# EAGLE design Wattuino-Uno_v11 (EAGLE 7.5.0)
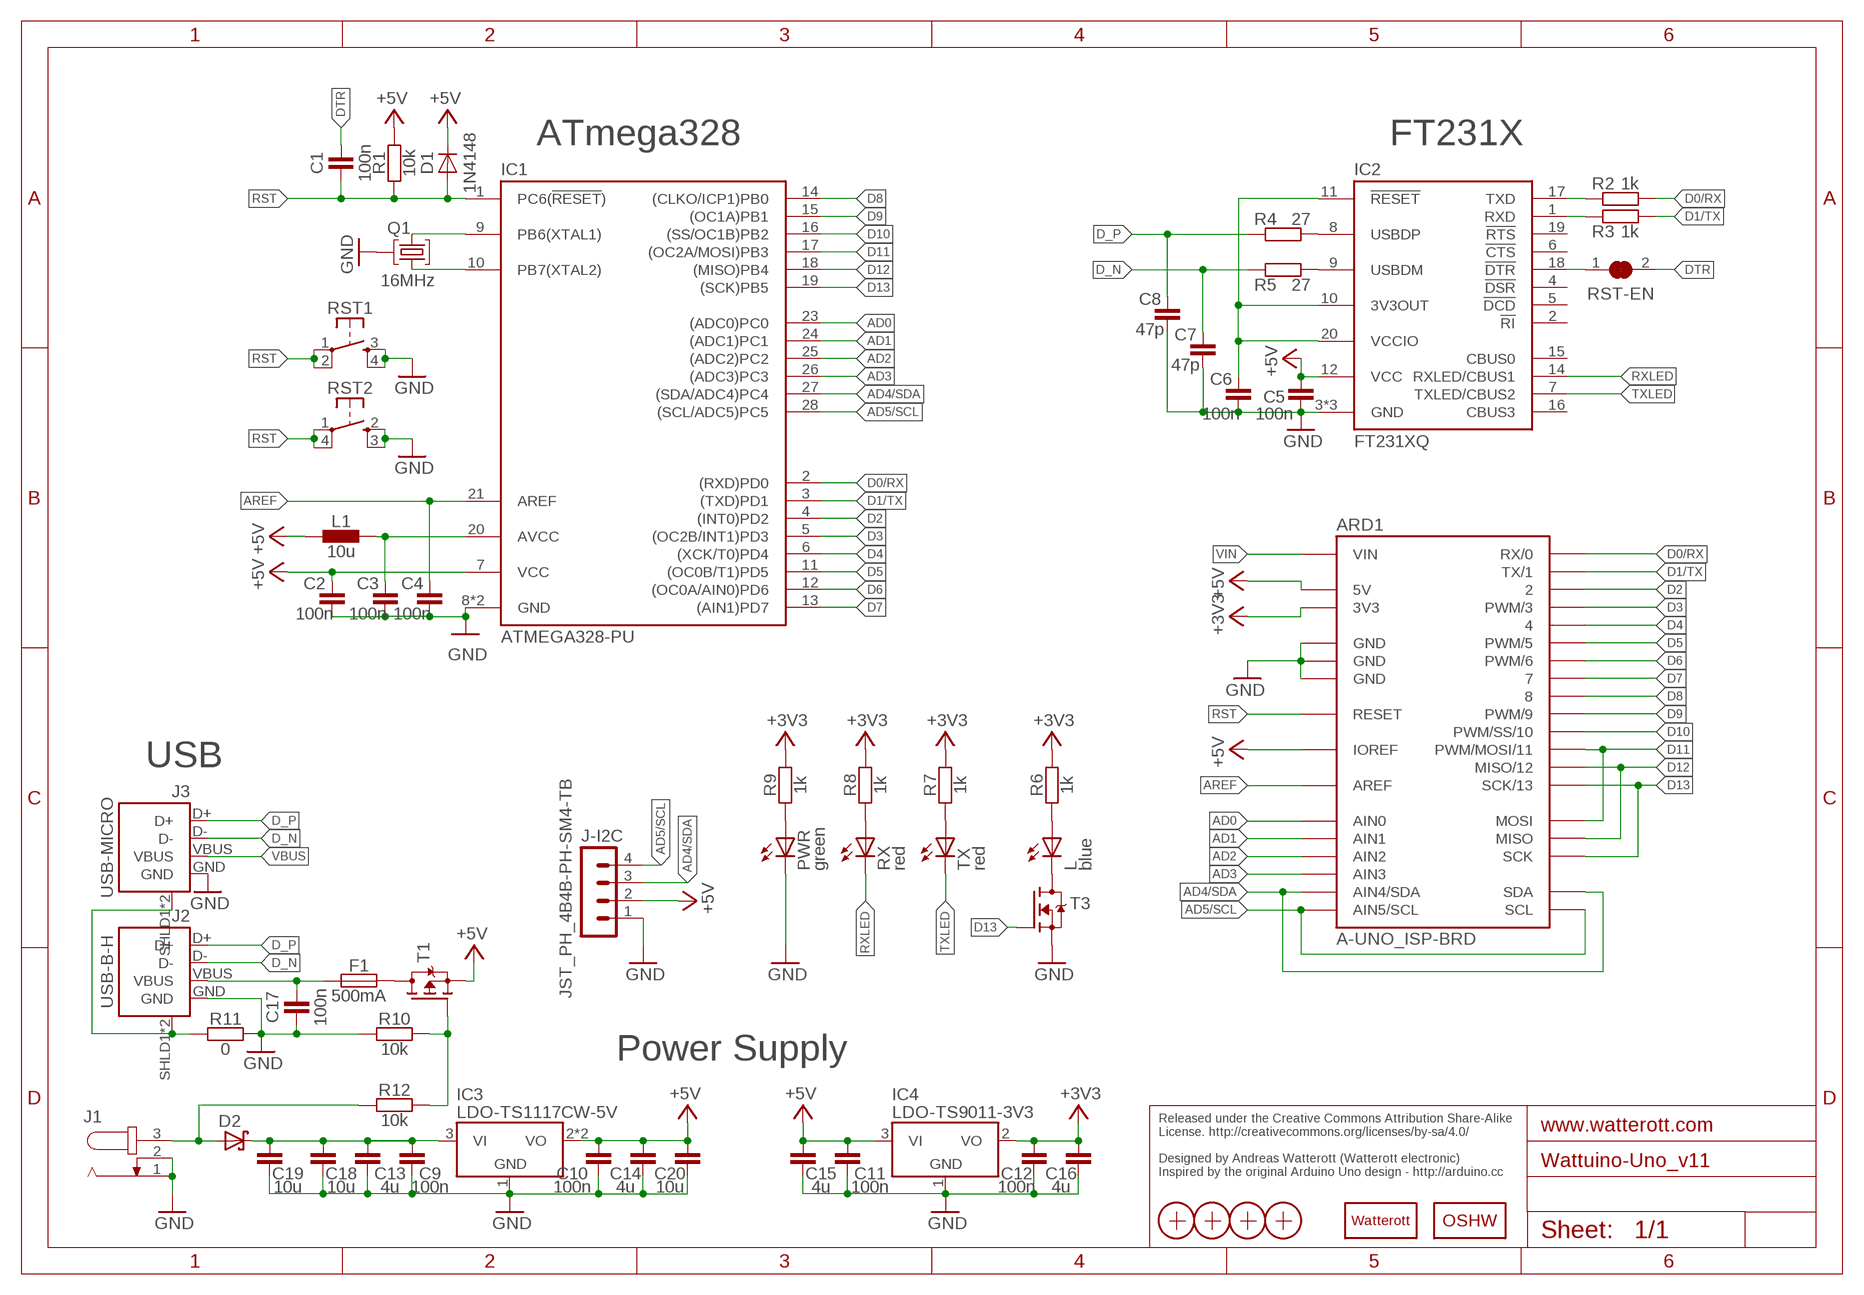
[diagram p0: schematic, sheet 1]

## Parts
ARD1  A-UNO_ISP-BRD  [A-UNO-ISP]
C1  100n  CAPACITOR-0402  [C0402]
C2  100n  CAPACITOR-0402  [C0402]
C3  100n  CAPACITOR-0402  [C0402]
C4  100n  CAPACITOR-0402  [C0402]
C5  100n  CAPACITOR-0402  [C0402]
C6  100n  CAPACITOR-0402  [C0402]
C7  47p  CAPACITOR-0402  [C0402]
C8  47p  CAPACITOR-0402  [C0402]
C9  100n  CAPACITOR-0402  [C0402]
C10  100n  CAPACITOR-0402  [C0402]
C11  100n  CAPACITOR-0402  [C0402]
C12  100n  CAPACITOR-0402  [C0402]
C13  4u  CAPACITOR-0603  [C0603]
C14  4u  CAPACITOR-0603  [C0603]
C15  4u  CAPACITOR-0603  [C0603]
C16  4u  CAPACITOR-0603  [C0603]
C17  100n  CAPACITOR-0402  [C0402]
C18  10u  CAPACITOR-1206  [C1206]
C19  10u  CAPACITOR-1206  [C1206]
C20  10u  CAPACITOR-1206  [C1206]
D1  1N4148  DIODE-SOD110  [SOD110]
D2  D_SCHOTTKY-SMA  [SMA_DO214AC]
F1  500mA  FUSE-0805  [C0805]
IC1  ATMEGA328-PU  [DIL28]
IC2  FT231XQ  [QFN20-PAD]
IC3  LDO-TS1117CW-5V  [SOT223]
IC4  LDO-TS9011-3V3  [SOT23]
J1  DC-JACK  [DC-JACK]
J2  USB-B-H  [USB-B-H]
J3  USB-MICRO  [USB-MICRO-10103594]
J-I2C  JST_PH_4B4B-PH-SM4-TB  [JST_B4B-PH-SM4-TB]
L  blue  LED-0603  [C0603]
L1  10u  INDUCTOR-0603  [C0603]
LOGO1  LOGO-S_PLACE_M  [SPARK_TPLACE_M]
LOGO2  OSHW_LOGOX0100  [OSHW_6X100]
PWR  green  LED-0603  [C0603]
Q1  16MHz  CRYSTAL-RES-32  [CRYSTAL_32X13]
R1  10k  RESISTOR-0402  [C0402]
R2  1k  RESISTOR-0402  [C0402]
R3  1k  RESISTOR-0402  [C0402]
R4  27  RESISTOR-0402  [C0402]
R5  27  RESISTOR-0402  [C0402]
R6  1k  RESISTOR-0402  [C0402]
R7  1k  RESISTOR-0402  [C0402]
R8  1k  RESISTOR-0402  [C0402]
R9  1k  RESISTOR-0402  [C0402]
R10  10k  RESISTOR-0402  [C0402]
R11  0  RESISTOR-0402  [C0402]
R12  10k  RESISTOR-0402  [C0402]
RST1  SW-TACTILE-PTS840P  [PTS840P]
RST2  SW-TACTILE-TL3315  [TL3315N]
RST-EN  JUMPER2-0603  [JUMPER2-0603]
RX  red  LED-0603  [C0603]
T1  MOSFET-P-SOT23  [SOT23]
T3  MOSFET-N-SOT23  [SOT23]
TX  red  LED-0603  [C0603]
X1  PASSER-07  [PASSER_07MM]
X2  PASSER-07  [PASSER_07MM]
X3  PASSER-07  [PASSER_07MM]
X4  PASSER-07  [PASSER_07MM]

## Nets
3V3OUT: C6.2 IC2.10(3V3OUT) IC2.11(!RESET) IC2.20(VCCIO)
+3V3: ARD1.3V3 C12.2 C16.2 IC4.2(VO) R6.2 R7.2 R8.2 R9.2
+5V: ARD1.5V ARD1.IOREF ARD1.VCC(5V) C2.2 C5.2 C10.2 C11.2 C14.2 C15.2 C20.2 D1.C IC1.7(VCC) IC2.12(VCC) IC3.2(VO) IC3.4(VO) IC4.3(VI) J-I2C.2 L1.1 R1.2 T1.2(S)
AD0: ARD1.A0(AIN0) IC1.23((ADC0)PC0)
AD1: ARD1.A1(AIN1) IC1.24((ADC1)PC1)
AD2: ARD1.A2(AIN2) IC1.25((ADC2)PC2)
AD3: ARD1.A3(AIN3) IC1.26((ADC3)PC3)
AD4/SDA: ARD1.A4(AIN4/SDA) ARD1.SDA IC1.27((SDA/ADC4)PC4) J-I2C.3
AD5/SCL: ARD1.A5(AIN5/SCL) ARD1.SCL IC1.28((SCL/ADC5)PC5) J-I2C.4
AREF: ARD1.AREF C4.2 IC1.21(AREF)
AVCC: C3.2 IC1.20(AVCC) L1.2
D0/RX: ARD1.0(RX/0) IC1.2((RXD)PD0) R2.2
D1/TX: ARD1.1(TX/1) IC1.3((TXD)PD1) R3.2
D2: ARD1.2 IC1.4((INT0)PD2)
D3: ARD1.3(PWM/3) IC1.5((OC2B/INT1)PD3)
D4: ARD1.4 IC1.6((XCK/T0)PD4)
D5: ARD1.5(PWM/5) IC1.11((OC0B/T1)PD5)
D6: ARD1.6(PWM/6) IC1.12((OC0A/AIN0)PD6)
D7: ARD1.7 IC1.13((AIN1)PD7)
D8: ARD1.8 IC1.14((CLKO/ICP1)PB0)
D9: ARD1.9(PWM/9) IC1.15((OC1A)PB1)
D10: ARD1.10(PWM/SS/10) IC1.16((SS/OC1B)PB2)
D11: ARD1.11(PWM/MOSI/11) ARD1.MOSI IC1.17((OC2A/MOSI)PB3)
D12: ARD1.12(MISO/12) ARD1.MISO IC1.18((MISO)PB4)
D13: ARD1.13(SCK/13) ARD1.SCK IC1.19((SCK)PB5) T3.1(G)
D_N: C7.2 J2.D- J3.D- R5.1
D_P: C8.2 J2.D+ J3.D+ R4.1
DN: IC2.9(USBDM) R5.2
DP: IC2.8(USBDP) R4.2
DTR: C1.2 RST-EN.2
DTR_FT: IC2.18(!DTR) RST-EN.1
GND: ARD1.GND@1(GND) ARD1.GND@2(GND) ARD1.GND@3(GND) ARD1.GND@4(GND) C2.1 C3.1 C4.1 C5.1 C6.1 C7.1 C8.1 C9.1 C10.1 C11.1 C12.1 C13.1 C14.1 C15.1 C16.1 C17.1 C18.1 C19.1 C20.1 IC1.8(GND) IC1.22(GND) IC2.3(GND) IC2.13(GND) IC2.TP(GND) IC3.1(GND) IC4.1(GND) J1.1 J1.2 J2.GND J3.GND J-I2C.1 PWR.C Q1.GND R10.1 R11.2 RST1.3(S1) RST1.4(S2) RST2.2(S1) RST2.3(S2) T3.2(S)
N$1: PWR.A R9.1
N$7: L.C T3.3(D)
N$8: L.A R6.1
N$9: R7.1 TX.A
N$10: R8.1 RX.A
RST: ARD1.RST@1(RESET) ARD1.RST@2(RESET) C1.1 D1.A IC1.1(PC6(!RESET!)) R1.1 RST1.1 RST1.2 RST2.1 RST2.4(P2)
RX_FT: IC2.1(RXD) R3.1
RXLED: IC2.14(RXLED/CBUS1) RX.C
SHLD: J2.SHLD1(SHIELD) J2.SHLD2(SHIELD) J3.SHLD1(SHIELD) J3.SHLD2(SHIELD) R11.1
TX_FT: IC2.17(TXD) R2.1
TXLED: IC2.7(TXLED/CBUS2) TX.C
USBVCC: F1.2 T1.3(D)
VBUS: C17.2 F1.1 J2.VBUS J3.VBUS
VEXT: D2.A J1.3 R12.1
VEXT2: R10.2 R12.2 T1.1(G)
VIN: ARD1.VIN C9.2 C13.2 C18.2 C19.2 D2.C IC3.3(VI)
XTAL1: IC1.9(PB6(XTAL1)) Q1.2
XTAL2: IC1.10(PB7(XTAL2)) Q1.1
Unconnected: IC2.2(!RI) IC2.4(!DSR) IC2.5(!DCD) IC2.6(!CTS) IC2.15(CBUS0) IC2.16(CBUS3) IC2.19(!RTS)

## Notes on the sheet
- ATmega328 | FT231X
- USB
- Power Supply
- Released under the Creative Commons Attribution Share-Alike 
  License. http://creativecommons.org/licenses/by-sa/4.0/
  
  Designed by Andreas Watterott (Watterott electronic)
  Inspired by the original Arduino Uno design - http://arduino.cc

## Library data of the parts
ARD1 = we-board:A-UNO_ISP: Arduino Uno with ISP connector
C1-C20 = we-rcl:CAPACITOR: Capacitors ...4.7uF @ 6.3V -> 0402 ...10uF @ 16V -> 0603 ...22uF @ 25V -> 0805
D1 = we-rcl:DIODE: Diodes
D2 = we-rcl:D_SCHOTTKY: Schottky Diodes
F1 = we-rcl:FUSE: Fuses
IC1 = we-chip:ATMEGA328-PU: Atmel ATmega48/88/168/328 AVR Microcontroller
IC2 = we-chip:FT231X: FTDI FT231X USB to UART Bridge (5V tolerant inputs); DIGIKEY: 768-1128-6-ND
IC3 IC4 = we-power:LDO: LDOs TS1117 800mA max 15V - compatible NCP1117 1A max 20V TS9011 250mA max 12V - compatible AP2210 300mA max 15V TS5204 150mA max 16V
J1 = we-con:DC-JACK: DC Jack (2.1mm)
J2 = we-con:USB: USB Connectors
J3 = we-con:USB: USB Connectors; DIGIKEY: 609-4050-6-ND
J-I2C = we-con:JST_PH_4: JST Connector
L PWR RX TX = we-opto:LED: LEDs
L1 = we-rcl:INDUCTOR: Inductors Ferrite Bead 0603 1.4A 220Ohm @ 100MH, -> Murata BLM18PG221SH1D 0603 1.0A 20Ohm @ 100MH -> Murata BLM18PG300SN1D
LOGO1 = we-symbol:LOGO: Watterott electronic Logo
LOGO2 = we-symbol:OSHW_LOGO: Open-Source-Hardware Logo
Q1 = we-rcl:CRYSTAL-RES: Crystal Resonators 8MHz and 16MHz -> 32x13
R1-R12 = we-rcl:RESISTOR: Resistors all kinds in 0603 and 0402
RST1 = we-switch:SW-TACTILE: Tactile Switches; DIGIKEY: CKN10511DKR-ND
RST2 = we-switch:SW-TACTILE: Tactile Switches; DIGIKEY: EG4621TR-ND
RST-EN = we-rcl:JUMPER2: 2 Pin Jumpers
T1 = we-transistor:MOSFET-P: P-Channel MOSFET (e.g. IRLML6402)
T3 = we-transistor:MOSFET-N: N-Channel MOSFET (e.g. IRLML2502, BSS138)
X1-X4 = we-symbol:PASSER: Fiducial Markers

## Board
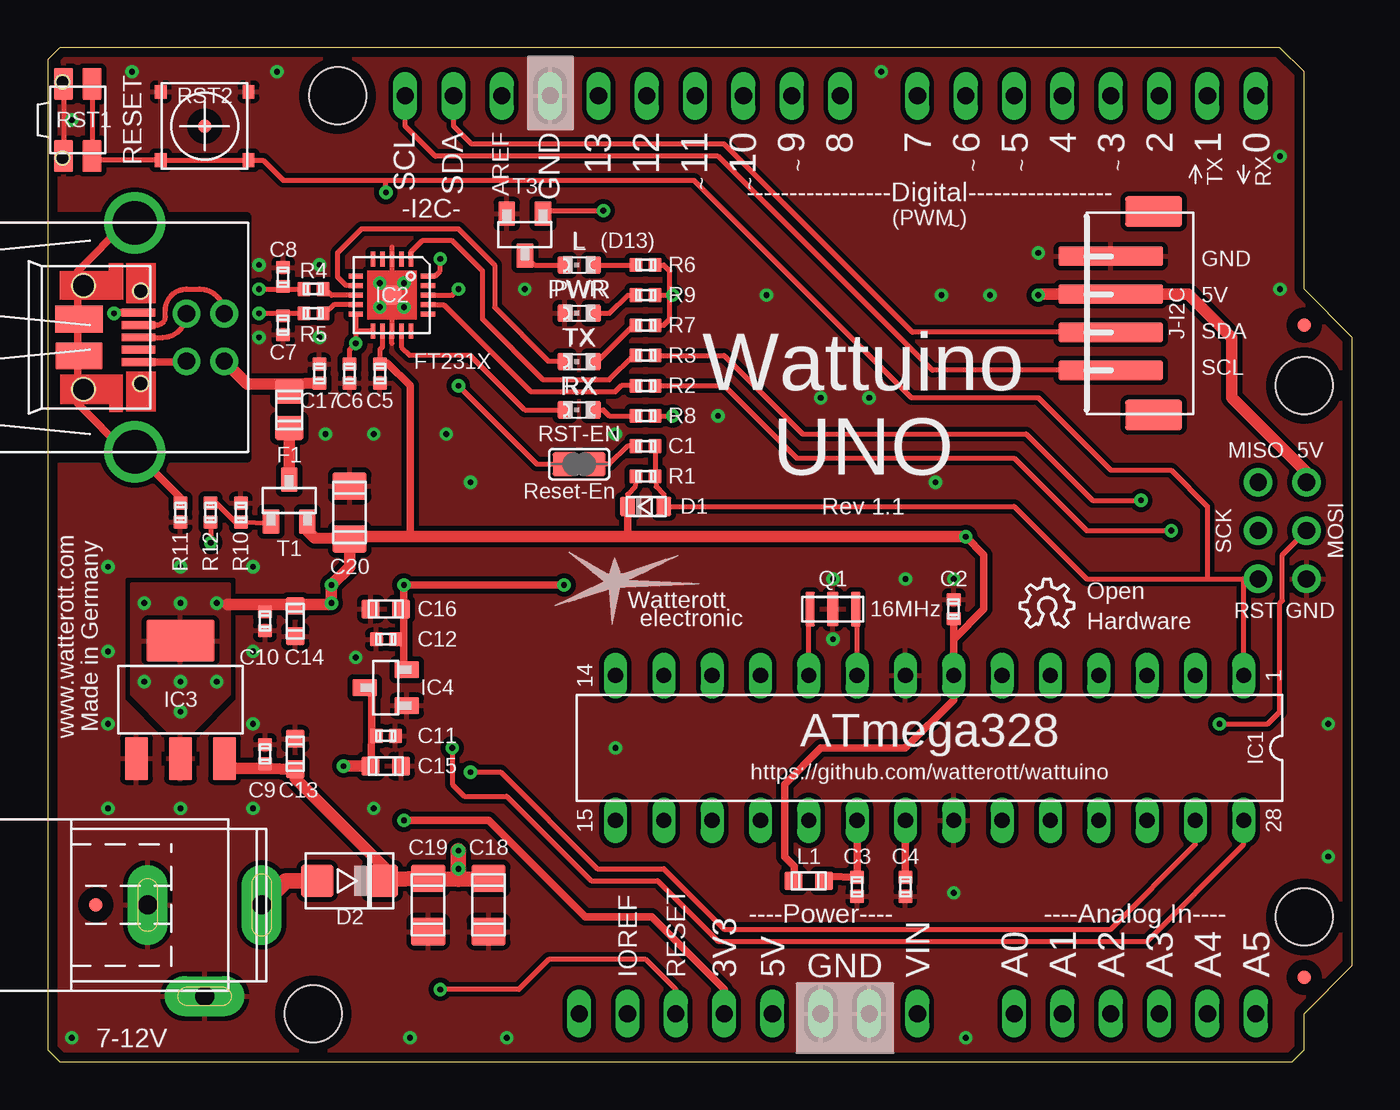
[diagram p1: board, top side]
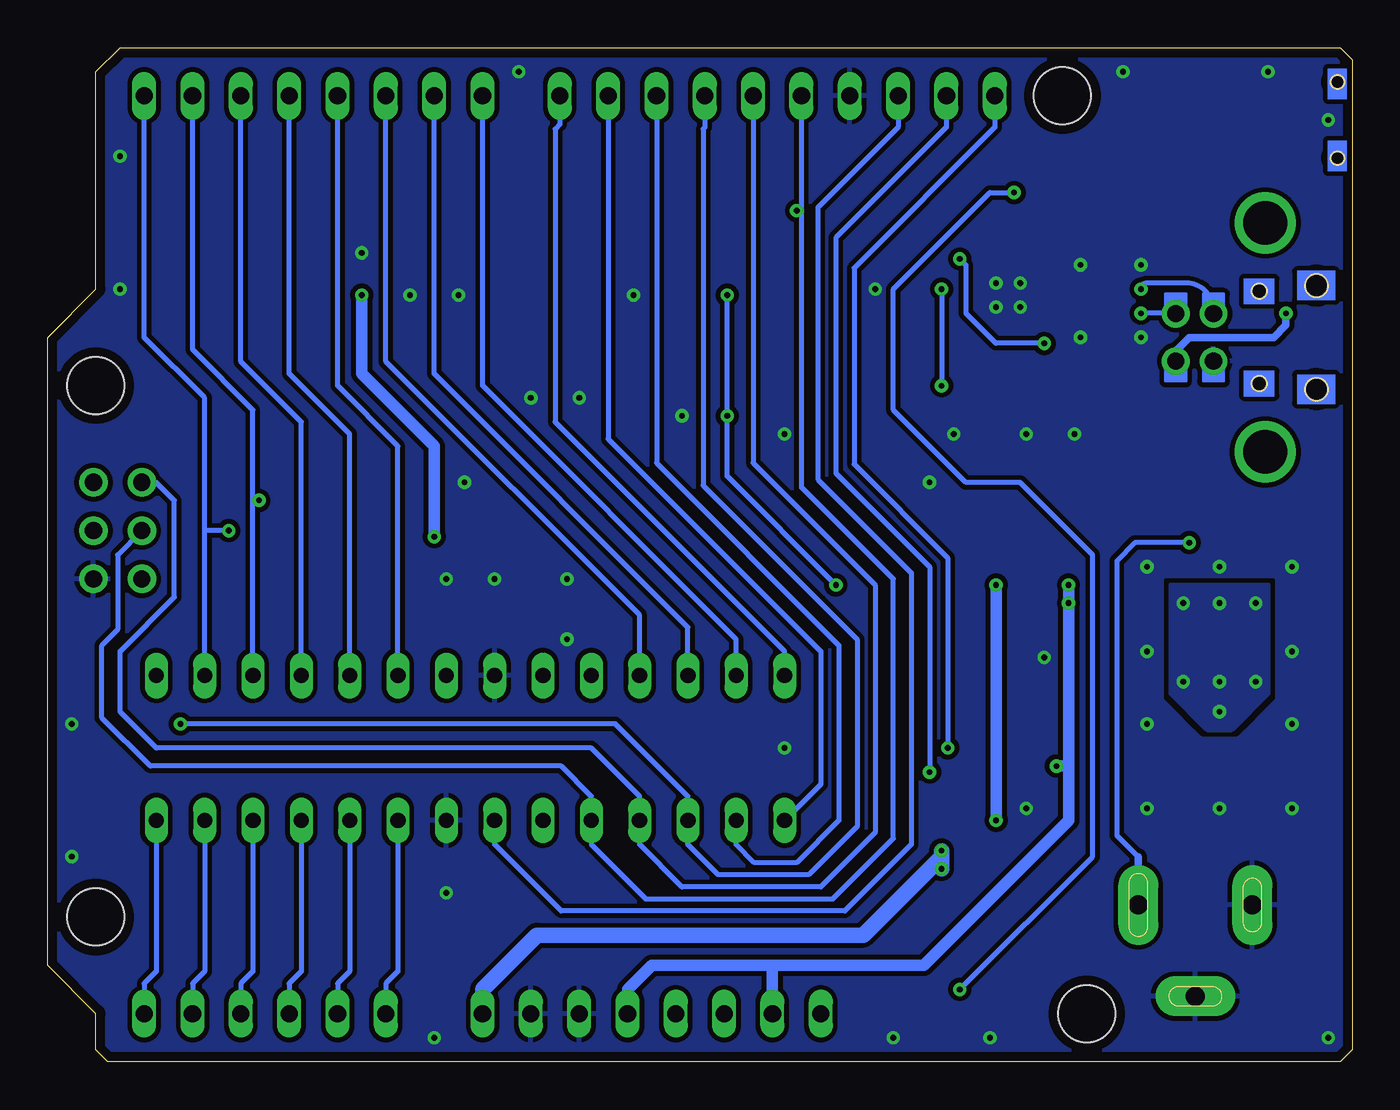
[diagram p2: board, bottom side, seen from below]

Size 68.58 x 53.34 mm. Coordinates in mm from the lower left corner, seen from the top.
Copper layers (1*16): Top 0.035mm / dielectric 1.5mm / Bottom 0.035mm
Design rules "we-dru": minimum track width 0.15mm, minimum drill 0.3mm, track to track 0.15mm, track to pad 0.15mm, pad to pad 0.15mm, via to via 0.15mm, smd to smd 0.1mm, copper to edge 0.5mm, drill to drill 0.2mm, minimum pad ring 0.18mm, minimum via ring 0.2mm, stop-mask expansion 0.1mm, vias tented up to drill 0.5mm, thermal gap 0.25mm
tRestrict: area 0.3,31.8 to 10.5,44.5

### Footprints (pad centres in the part's own frame; a part is rotated, then mirrored left to right if it is on the bottom)
A-UNO-ISP = drill 0.9 pad 1.2 long: 0 63.5,50.8; 1 60.96,50.8; 2 58.42,50.8; 3 55.88,50.8; 3V3 35.56,2.54; 4 53.34,50.8; 5 50.8,50.8; 5V 38.1,2.54; 6 48.26,50.8; 7 45.72,50.8; 8 41.656,50.8; 9 39.116,50.8; 10 36.576,50.8; 11 34.036,50.8; 12 31.496,50.8; 13 28.956,50.8; A0 50.8,2.54; A1 53.34,2.54; A2 55.88,2.54; A3 58.42,2.54; A4 60.96,2.54; A5 63.5,2.54; AREF 23.876,50.8; GND@1 40.64,2.54; GND@2 43.18,2.54; GND@3 26.416,50.8; IOREF 30.48,2.54; NC 27.94,2.54; RST@1 33.02,2.54; SCL 18.796,50.8; SDA 21.336,50.8; VIN 45.72,2.54 | drill 0.9 pad 1.5: GND@4 66.167,25.4; MISO 63.627,30.48; MOSI 66.167,27.94; RST@2 63.627,25.4; SCK 63.627,27.94; VCC 66.167,30.48 | hole 3: 66.04,35.56; 66.04,7.62; 15.24,50.8; 13.97,2.54
C0402 = smd 0.75 x 0.7: 1 0,0.5; 2 0,-0.5
C0603 = smd 1 x 0.95: 1 0,0.8; 2 0,-0.8
C1206 = smd 1.8 x 1.45: 1 0,1.4; 2 0,-1.4
SOD110 = smd 1 x 0.8: A 0,-0.95; C 0,0.95
SMA_DO214AC = smd 1.7 x 1.7: A 0,-1.7; C 0,1.7
C0805 = smd 1.5 x 1.25: 1 0,0.95; 2 0,-0.95
DIL28 = drill 0.8 pad 1.2 long: 1 -3.81,16.51; 2 -3.81,13.97; 3 -3.81,11.43; 4 -3.81,8.89; 5 -3.81,6.35; 6 -3.81,3.81; 7 -3.81,1.27; 8 -3.81,-1.27; 9 -3.81,-3.81; 10 -3.81,-6.35; 11 -3.81,-8.89; 12 -3.81,-11.43; 13 -3.81,-13.97; 14 -3.81,-16.51; 15 3.81,-16.51; 16 3.81,-13.97; 17 3.81,-11.43; 18 3.81,-8.89; 19 3.81,-6.35; 20 3.81,-3.81; 21 3.81,-1.27; 22 3.81,1.27; 23 3.81,3.81; 24 3.81,6.35; 25 3.81,8.89; 26 3.81,11.43; 27 3.81,13.97; 28 3.81,16.51
QFN20-PAD = smd 0.8 x 0.28: 1 -1.9,1; 2 -1.9,0.5; 3 -1.9,0; 4 -1.9,-0.5; 5 -1.9,-1; 11 1.9,-1; 12 1.9,-0.5; 13 1.9,0; 14 1.9,0.5; 15 1.9,1 | smd 0.28 x 0.8: 6 -1,-1.9; 7 -0.5,-1.9; 8 0,-1.9; 9 0.5,-1.9; 10 1,-1.9; 16 1,1.9; 17 0.5,1.9; 18 0,1.9; 19 -0.5,1.9; 20 -1,1.9 | smd 1 x 1: TP 0,0
SOT223 = smd 2.235 x 1.219: 1 -3.099,2.311; 2 -3.099,0; 3 -3.099,-2.311 | smd 2.2 x 3.6: 4 3.099,0
SOT23 = smd 1.3 x 0.9: 1 -1.1,0.95; 2 -1.1,-0.95; 3 1.1,0
DC-JACK = drill 1 pad 2.1 long: 1 3,0; 2 0,4.8; 3 -3,0
USB-B-H = drill 0.9 pad 1.45: D+ 0,-1.25; D- -1.985,-1.25; GND 0,1.25; VBUS -1.985,1.25 | drill 2.3: SHLD1 2.718,6.02; SHLD2 2.718,-6.02
USB-MICRO-10103594 = smd 1.8 x 0.4: D+ -2.885,0; D- -2.885,-0.65; GND -2.885,1.3; ID -2.885,0.65; VBUS -2.885,-1.3 | smd 2.5 x 1.425: SHLD1 0.25,-0.963; SHLD2 0.25,0.963 | hole 0.8: -3,2.425; -3,-2.425 | hole 1.2: 0.01,2.725; 0.01,-2.725
JST_B4B-PH-SM4-TB = smd 5.5 x 1: 1 0,3; 2 0,1; 3 0,-1; 4 0,-3 | smd 3 x 1.6: SHLD1 2.25,5.35; SHLD2 2.25,-5.35
C0603' = smd 0.9 x 0.8: A 0,-0.75; C 0,0.75
CRYSTAL_32X13 = smd 1.8 x 0.5: 1 0,1.2; 2 0,-1.2 | smd 1.8 x 0.6: GND 0,0
PTS840P = smd 1.65 x 1: 1 -1.9,0.75; 2 1.9,0.75; 3 -1.9,-0.75; 4 1.9,-0.75 | hole 0.7: -2,-0.8; 2,-0.8
TL3315N = smd 0.65 x 0.7: 1 -2.3,1.8; 2 -2.3,-1.8; 3 2.3,-1.8; 4 2.3,1.8
JUMPER2-0603 = smd 1.25 x 1.25: 1 0,0.76; 2 0,-0.76
PASSER_07MM = smd 0.7 x 0.7: X 0,0

### Placement (x,y rotation side)
ARD1  0,0 0 top
C1  31.43,32.38 270 top
C2  47.62,23.81 0 top
C3  42.55,9.21 180 top
C4  45.09,9.21 180 top
C5  17.46,36.2 180 top
C6  15.88,36.2 180 top
C7  12.38,38.73 180 top
C8  12.38,41.27 0 top
C9  11.43,16.19 0 top
C10  11.43,23.18 180 top
C11  17.78,17.14 270 top
C12  17.78,22.23 90 top
C13  13.02,16.19 0 top
C14  13.02,23.18 180 top
C15  17.78,15.56 270 top
C16  17.78,23.81 90 top
C17  14.29,36.2 0 top
C18  23.18,8.26 180 top
C19  20,8.26 180 top
C20  15.88,28.89 0 top
D1  31.43,29.21 90 top
D2  15.88,9.53 270 top
F1  12.7,34.29 0 top
IC1  46.35,16.51 270 top
IC2  18.1,40.32 270 top
IC3  6.99,19.05 90 top
IC4  17.78,19.68 180 top
J1  8.26,8.26 180 top
J2  7.3,38.1 180 top
J3  1.91,38.1 180 top
J-I2C  55.88,39.37 0 top
L  blue  [C0603']  27.94,41.91 90 top
L1  40.01,9.53 90 top
LOGO1  29.84,25.24 0 top
LOGO2  51.12,22.86 0 top
PWR  green  [C0603']  27.94,39.37 90 top
Q1  41.27,23.81 90 top
R1  31.43,30.8 270 top
R2  31.43,35.56 90 top
R3  31.43,37.15 90 top
R4  13.97,40.64 90 top
R5  13.97,39.37 90 top
R6  31.43,41.91 90 top
R7  31.43,38.73 90 top
R8  31.43,33.97 90 top
R9  31.43,40.32 90 top
R10  10.16,28.89 0 top
R11  6.99,28.89 0 top
R12  8.57,28.89 180 top
RST1  1.59,49.53 270 top
RST2  8.26,49.21 180 top
RST-EN  27.94,31.43 90 top
RX  red  [C0603']  27.94,34.29 90 top
T1  12.7,29.53 90 top
T3  25.08,43.5 270 top
TX  red  [C0603']  27.94,36.83 90 top
X1  2.54,8.26 0 top
X2  8.26,49.21 0 top
X3  66.04,38.73 0 top
X4  66.04,4.45 0 top

### Tracks (layer width: path | path; a pad name or v marks a point on that pad's centre or on a via)
3V3OUT  (via drill 0.3)
  Top 0.254: IC2.10 16.2,38.42 | 16.2,38.42 v16.2,37.78 15.88,37.47 15.88,36.75 C6.2 | IC2.11 16.2,38.42 | IC2.20 20.37,41.32 20.64,41.59 v20.64,42.23
  Bottom 0.254: v20.64,42.23 20.32,41.91 20.32,39.37 18.74,37.79 v16.19,37.79 v16.2,37.78
+3V3  (via drill 0.3)
  Top 0.254: R7.2 32.38,38.73 32.7,39.05 32.7,40.32 | R8.2 v32.86,33.97 | v32.86,40.32 32.7,40.32 | 32.7,40.32 32.7,41.59 32.38,41.91 R6.2 | R9.2 32.7,40.32
  Top 0.406: 18.65,20.87 IC4.2 18.73,20.64 18.73,22.23 | ARD1.3V3 35.56,3.81 31.75,7.62 28.26,7.62 23.18,12.7 v18.73,12.7 | C12.2 18.73,22.23 | 18.73,23.81 v18.73,25.08 v27.15,25.08 | 18.73,23.81 18.73,22.23 | C16.2 18.73,23.81
  Bottom 0.254: v32.86,40.32 v32.86,33.97 32.86,30.8 v27.15,25.08
  Bottom 0.61: v18.73,12.7 v18.73,25.08
+5V  (via drill 0.3)
  Top 0.254: IC2.12 17.6,37.6 17.46,37.47 C5.2 17.86,36.74 | 12.9,24.05 C14.2 | R1.2 30.88,30.25 30.48,29.84 D1.C | 30.48,27.62
  Top 0.406: 16.91,19.45 IC4.3 16.83,19.68 17.03,19.48 17.03,17.14 | 13.33,24.05 13.34,24.05 | C10.2 11.43,24.05 | C15.2 17.03,17.14 | C11.2 17.03,17.14 | 17.86,36.74 19.05,35.56 19.05,27.62 | L1.1 39.26,10.28 38.73,10.79 38.73,14.61 40.64,16.51 45.09,16.51 47.62,19.05 IC1.7 47.62,22.23 | 47.62,22.23 49.21,23.81 49.21,26.67 v48.26,27.62 | C2.2 47.62,22.23 | C20.2 16.43,27.54 16.51,27.62 | 52.12,40.37 v52.07,40.32 | D1.C 30.48,27.62
  Top 0.61: C15.2 v15.56,15.56 | 9.44,24.05 11.43,24.05 12.9,24.05 13.34,24.05 14.84,24.05 v14.92,24.13 v14.92,25.08 15.88,26.04 C20.2 14.05,27.54 13.65,27.94 T1.2 | 16.51,27.62 19.05,27.62 30.48,27.62 v48.26,27.62 | 52.12,40.37 J-I2C.2 59.96,40.37 62.23,38.1 62.23,34.92 66.17,30.99 ARD1.VCC
  Bottom 0.61: ARD1.5V 38.1,3.81 36.83,5.08 30.48,5.08 | 30.48,5.08 ARD1.IOREF | 30.48,5.08 22.54,5.08 14.92,12.7 14.92,15.56 | 14.92,15.56 v14.92,25.08 | v15.56,15.56 14.92,15.56 | v48.26,27.62 48.26,32.38 52.07,36.2 v52.07,40.32
  other vias: 6.99,24.13 5.08,24.13 8.89,24.13 5.08,20 6.99,20 8.89,20 6.99,18.41
  pour Top (isolate 0.254): 4.45,25.08 4.45,19.37 6.35,17.46 6.35,14.92 7.62,14.92 7.62,17.46 9.53,19.37 9.53,25.08
  pour Bottom (isolate 0.254): 4.45,25.08 4.45,19.37 6.35,17.46 7.62,17.46 9.53,19.37 9.53,25.08
AD0
  Bottom 0.254: IC1.23 50.16,4.76 50.8,4.13 ARD1.A0
AD1
  Bottom 0.254: IC1.24 52.7,4.76 53.34,4.13 ARD1.A1
AD2
  Bottom 0.254: IC1.25 55.24,4.76 55.88,4.13 ARD1.A2
AD3
  Bottom 0.254: IC1.26 57.78,4.76 58.42,4.13 ARD1.A3
AD4/SDA  (via drill 0.3)
  Top 0.254: v22.23,15.24 23.81,15.24 28.89,10.16 32.38,10.16 35.56,6.99 55.88,6.99 60.33,11.43 IC1.27 | J-I2C.3 45.45,38.37 35.56,48.26 22.29,48.26 21.34,49.21 ARD1.SDA
  Bottom 0.254: IC1.27 60.33,4.76 60.96,4.13 ARD1.A4 | ARD1.SDA 21.34,49.15 27.15,43.34 27.15,30.96 22.23,26.04 v22.23,15.24
AD5/SCL  (via drill 0.3)
  Top 0.254: v21.27,16.51 21.27,14.61 21.91,13.97 24.13,13.97 28.57,9.53 32.07,9.53 35.24,6.35 57.78,6.35 62.87,11.43 IC1.28 | J-I2C.4 46.5,36.37 35.24,47.62 20.38,47.62 18.8,49.21 ARD1.SCL
  Bottom 0.254: IC1.28 62.87,4.76 63.5,4.13 ARD1.A5 | ARD1.SCL 18.8,49.15 26.19,41.75 26.19,31.43 21.27,26.51 v21.27,16.51
AREF
  Top 0.406: C4.2 IC1.21
  Bottom 0.254: ARD1.AREF 23.88,49.15 28.1,44.93 28.1,30.64 23.18,25.72 23.18,11.43 26.67,7.94 41.59,7.94 45.09,11.43 IC1.21
AVCC
  Top 0.406: IC1.20 C3.2 40.99,9.76 L1.2
D0/RX  (via drill 0.3)
  Top 0.254: R2.2 35.56,35.56 39.37,31.75 50.8,31.75 54.61,27.94 v59.05,27.94
  Bottom 0.254: IC1.2 60.33,27.94 | 60.33,27.94 60.33,34.92 63.5,38.1 ARD1.0 | v59.05,27.94 60.33,27.94
D1/TX  (via drill 0.3)
  Top 0.254: R3.2 35.56,37.15 39.69,33.02 51.44,33.02 54.93,29.53 v57.47,29.53
  Bottom 0.254: IC1.3 57.78,29.53 | 57.78,29.53 57.78,34.29 60.96,37.47 ARD1.1 | v57.47,29.53 57.78,29.53
D2
  Bottom 0.254: IC1.4 55.24,33.66 58.42,36.83 ARD1.2
D3
  Bottom 0.254: IC1.5 52.7,33.02 55.88,36.2 ARD1.3
D4
  Bottom 0.254: IC1.6 50.16,32.38 53.34,35.56 ARD1.4
D5
  Bottom 0.254: IC1.11 37.47,23.5 50.8,36.83 ARD1.5
D6
  Bottom 0.254: IC1.12 34.92,22.86 48.26,36.2 ARD1.6
D7
  Bottom 0.254: IC1.13 32.38,22.23 45.72,35.56 ARD1.7
D8
  Bottom 0.254: IC1.14 29.84,21.59 41.91,33.66 41.91,49.05 41.66,49.31 ARD1.8
D9
  Bottom 0.254: ARD1.9 39.12,32.77 27.94,21.59 27.94,14.61 IC1.15
D10
  Bottom 0.254: IC1.16 32.38,11.43 31.43,10.48 29.21,10.48 26.99,12.7 26.99,21.91 36.58,31.5 ARD1.10
D11  (via drill 0.3)
  Top 0.254: v61.59,17.78 64.14,17.78 64.77,18.41 64.77,24.13 64.9,24.26 64.9,26.67 ARD1.MOSI
  Bottom 0.254: v61.59,17.78 38.73,17.78 34.92,13.97 IC1.17 34.92,11.43 33.34,9.84 28.57,9.84 26.04,12.38 26.04,22.23 34.13,30.32 34.13,49.05 34.04,49.15 ARD1.11
D12
  Bottom 0.254: ARD1.12 31.5,31.5 25.08,25.08 25.08,12.06 27.94,9.21 35.24,9.21 37.47,11.43 IC1.18 37.47,13.97 40.01,16.51 62.87,16.51 64.77,18.41 64.77,21.59 61.91,24.45 61.91,29.53 62.87,30.48 ARD1.MISO
D13  (via drill 0.3)
  Top 0.254: v29.21,44.77 26.04,44.77 T3.1
  Bottom 0.254: ARD1.13 28.96,44.77 | 28.96,44.77 28.96,30.23 24.13,25.4 24.13,11.75 27.3,8.57 37.15,8.57 40.01,11.43 IC1.19 40.01,13.97 41.59,15.56 63.18,15.56 65.72,18.1 65.72,21.91 64.9,22.73 64.9,26.67 ARD1.SCK | v29.21,44.77 28.96,44.77
D_N  (via drill 0.3)
  Top 0.254: v11.11,39.37 12.38,39.37 | 12.38,39.37 R5.1 | C7.2 12.38,39.37 | J3.D- 5.73,38.75 arc90 6.19,39.21 6.19,39.53 arc-90 7.3,40.64 7.99,40.64 arc-90 J2.D-
  Bottom 0.254: J2.D- arc-90 9.3,39.37 v11.11,39.37
D_P  (via drill 0.3)
  Top 0.254: v11.11,40.64 12.38,40.64 | 12.38,40.64 R4.1 | C8.2 12.38,40.64 | J3.D+ 6.05,38.1 arc90 J2.D+
  Bottom 0.254: J2.D+ arc-90 8.59,40.96 10.79,40.96 arc-90 v11.11,40.64
DN
  Top 0.254: IC2.9 15.06,39.82 14.61,39.37 R5.2
DP
  Top 0.254: IC2.8 14.92,40.32 14.61,40.64 R4.2
DTR
  Top 0.254: C1.2 30.48,32.38 29.53,31.43 RST-EN.2
DTR_FT  (via drill 0.3)
  Top 0.254: IC2.18 21.27,40.32 v21.59,40.64 | v21.59,35.56 25.72,31.43 RST-EN.1
  Bottom 0.254: v21.59,40.64 v21.59,35.56
GND  (via drill 0.3)
  Top 0.254: 18.1,39.69 IC2.13 18.1,37.78 | 18.1,42.86 IC2.3 IC2.TP 18.1,39.69 | 18.1,39.69 v18.73,39.69 v18.73,40.96 v17.46,40.96 v17.46,39.69 18.1,39.69 | RST1.3 0.84,49.53 | 0.84,49.53 RST1.4 | v1.27,49.53 0.84,49.53
  Top 0.406: J3.GND 7.25,36.8 J2.GND
  other vias: 41.27,25.4 41.27,22.23 11.11,38.1 11.11,41.91 4.45,52.07 43.81,52.07 12.06,52.07 64.77,47.62 64.77,40.64 67.31,10.79 67.31,17.78 47.62,25.4 47.62,8.89 3.17,13.34 6.99,13.34 10.79,13.34 3.17,17.78 3.17,21.59 10.79,17.78 10.79,21.59 10.79,26.04 3.17,26.04 6.99,26.04 16.19,21.27 17.14,13.34 14.29,38.1 14.29,41.91 45.09,25.4 48.26,1.27 24.13,1.27 19.05,1.27 20.95,33.02 14.61,33.02 17.14,33.02 1.27,1.27 29.84,16.51 25.08,40.64 43.18,34.92 46.67,30.48 52.07,42.55 40.64,34.92 35.24,33.97 22.23,30.48 37.78,40.32 46.99,40.32 49.53,40.32 29.84,33.02
  pour Top (isolate 0.254, rank 2): 68.58,0 0,0 0,53.34 68.58,53.34
  pour Bottom (isolate 0.254, rank 2): 0,0 68.58,0 68.58,53.34 0,53.34
N$1
  Top 0.254: PWR.A 29.53,39.37 30.48,40.32 R9.1
N$2
  Top 0.254: 27.37,31.43 28.57,31.43
N$7
  Top 0.254: T3.3 25.57,41.91 L.C
N$8
  Top 0.254: L.A R6.1
N$9
  Top 0.254: R7.1 30.8,38.73 28.89,36.83 TX.A
N$10
  Top 0.254: RX.A 29.21,34.29 29.53,33.97 R8.1
RST  (via drill 0.3)
  Top 0.254: RST1.1 RST1.2 2.56,47.41 RST2.4 RST2.1 11.32,47.41 12.38,46.35 17.78,46.35 | C1.1 R1.1 31.98,30.25 32.38,29.84 D1.A | D1.A | ARD1.RST@1 33.02,3.81 31.43,5.4 26.35,5.4 24.77,3.81 v20.64,3.81 | D1.A 50.8,29.21 54.61,25.4 60.96,25.4 | 60.96,25.4 62.87,25.4 | 62.87,25.4 ARD1.RST@2 | 17.78,46.35 33.97,46.35 45.4,34.92 52.07,34.92 55.88,31.11 59.05,31.11 60.96,29.21 60.96,25.4 | IC1.1 62.87,25.4 | v17.78,45.72 17.78,46.35
  Bottom 0.254: v20.64,3.81 13.65,10.79 13.65,26.67 17.46,30.48 20.32,30.48 24.13,34.29 24.13,40.64 19.05,45.72 v17.78,45.72
RX_FT
  Top 0.254: IC2.1 19.1,42.59 19.68,43.18 21.27,43.18 22.86,41.59 22.86,39.05 26.04,35.88 29.53,35.88 30.8,37.15 R3.1
RXLED
  Top 0.254: IC2.14 18.6,37.6 19.05,37.15 22.23,37.15 25.08,34.29 RX.C
SHLD
  Top 0.406: 1.59,37.15 1.59,34.61 4.12,32.08 J2.SHLD1 6.99,29.68 R11.1 | 1.59,37.15 1.59,39.05 | 1.59,39.05 1.59,41.59 4.12,44.12 J2.SHLD2 | J3.SHLD1 1.6,39.06 1.59,39.05 | J3.SHLD2 1.6,37.14 1.59,37.15
TX_FT
  Top 0.254: IC2.17 20.82,39.82 25.4,35.24 29.84,35.24 30.16,35.56 R2.1
TXLED
  Top 0.254: IC2.7 15.69,40.82 15.24,41.27 15.24,42.55 16.51,43.81 21.59,43.81 23.5,41.91 23.5,39.69 26.35,36.83 TX.C
USBVCC
  Top 0.61: F1.2 T1.3
VBUS  (via drill 0.3)
  Top 0.254: 3.52,39.4 v3.49,39.37
  Top 0.406: J3.VBUS 3.52,39.4
  Top 0.61: C17.2 12.7,35.65 | 12.7,35.65 10.49,35.65 J2.VBUS | F1.1 12.7,35.65
  Bottom 0.406: v3.49,39.37 3.49,38.73 4.13,38.1 8.57,38.1 9.29,37.38 J2.VBUS
VEXT  (via drill 0.3)
  Top 0.254: R12.1 v8.57,27.3
  Top 0.813: D2.A 12.53,9.53 J1.3
  Bottom 0.254: v8.57,27.3 11.43,27.3 12.38,26.35 12.38,11.91 11.26,10.78
  Bottom 0.406: J1.3 11.26,10.78
VEXT2
  Top 0.254: T1.1 11.66,28.34 R10.2 9.92,28.34 8.89,29.37 8.65,29.37 R12.2
VIN  (via drill 0.3)
  Top 0.61: 11.43,15.44 C13.2 13.02,14.92 17.78,10.16 17.78,9.61 | 11.43,15.44 9.8,15.44 IC3.3 | C9.2 11.43,15.44
  Top 0.813: v21.59,11.11 21.59,9.61 | C18.2 21.59,9.61 | 21.59,9.61 C19.2 17.78,9.61 17.66,9.61 D2.C
  Bottom 0.813: ARD1.VIN 45.72,3.81 42.86,6.67 25.72,6.67 21.59,10.79 | v21.59,10.16 21.59,10.79 | 21.59,10.79 v21.59,11.11
XTAL1
  Top 0.254: IC1.9 42.55,23.74 Q1.2
XTAL2
  Top 0.254: IC1.10 40.01,23.74 Q1.1

### Text on the board
tPlace: RESET | SCL | SDA | AREF | GND | 13 | 12 | 11 | 10 | 9 | 8 | 7 | 6 | 5 | 4 | 3 | 2 | 1 | 0 | ~ | ~ | ~ | ~ | TX | RX | ~ | ~ | -I2C- | -----------------Digital----------------- | (PWM ) | ~ | L | (D13) | GND | PWR | 5V | TX | SDA | FT231X | Wattuino | SCL | RX | UNO | MISO | 5V | Reset-En | Rev 1.1 | SCK | MOSI | Open | Watterott | 16MHz | RST | GND | electronic | Hardware | www.watterott.com | Made in Germany | 14 | 1 | ATmega328 | https://github.com/watterott/wattuino | 15 | 28 | ----Power---- | ----Analog In---- | IOREF | RESET | 3V3 | 5V | GND | VIN | A0 | A1 | A2 | A3 | A4 | A5 | 7-12V
Reference: Silkscreen: 21 tPlace